# Altium schematic sheet cs301_07b.SchDoc
size A4
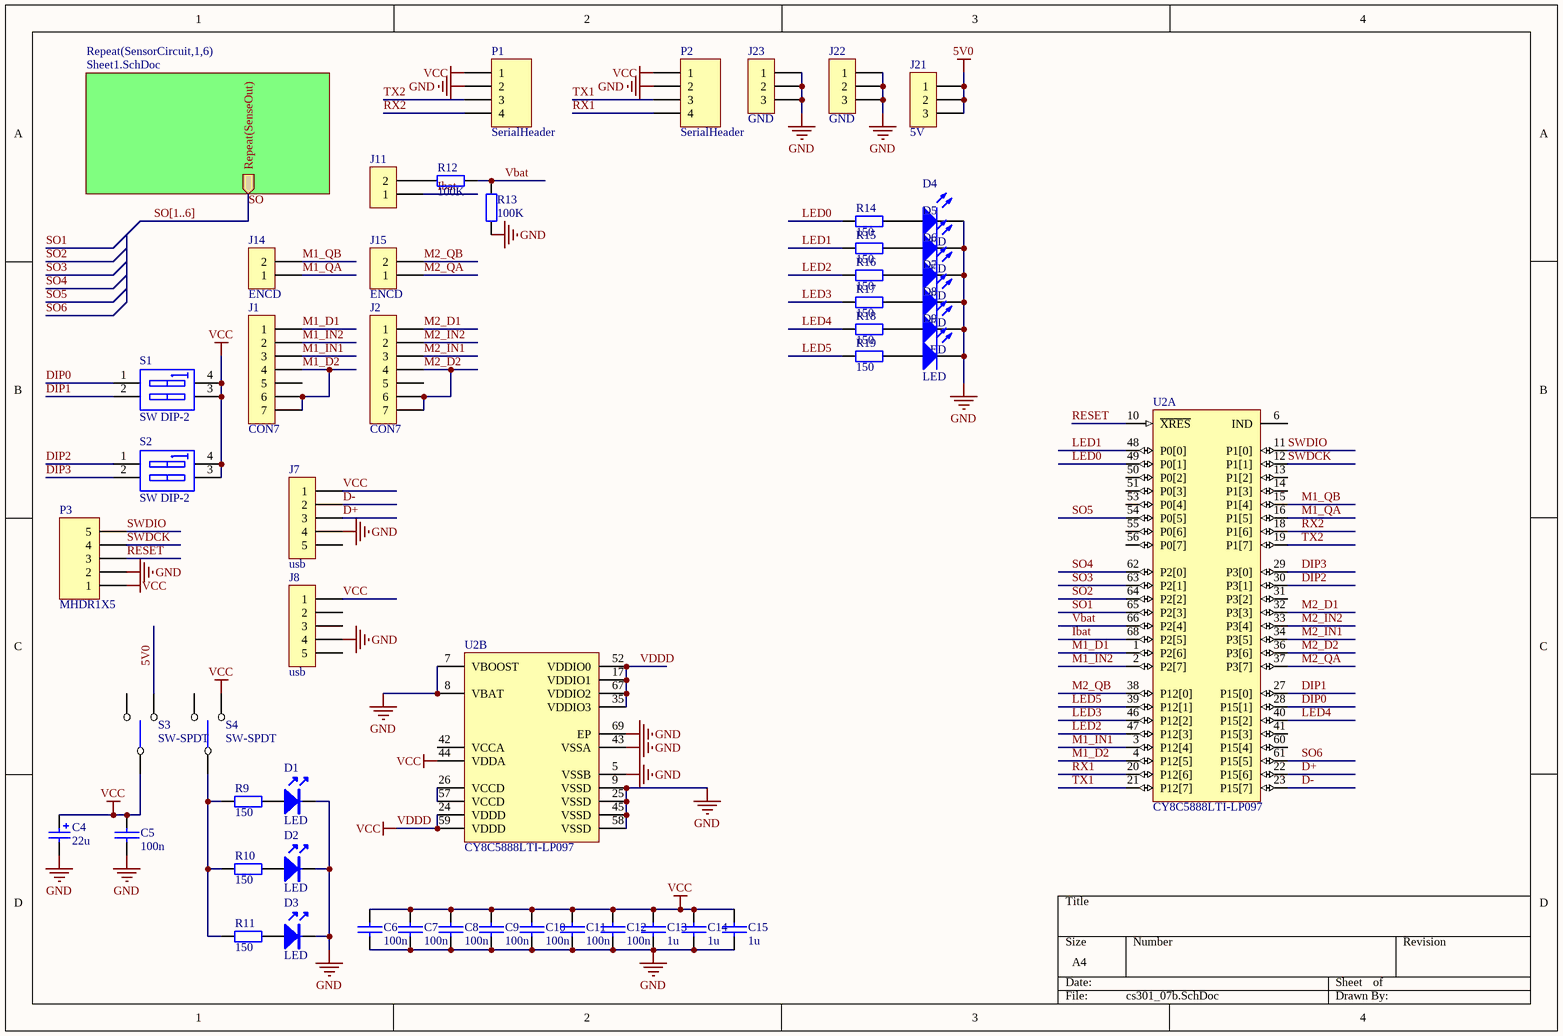
[diagram p0: cs301_07b.SchDoc]

## Parts
C4  22u  [ECE-CAPAE6.3X5.4SM]
C5  100n  [ECE-CAPC1608-0603SM]
C6  100n  [ECE-CAPC1608-0603SM]
C7  100n  [ECE-CAPC1608-0603SM]
C8  100n  [ECE-CAPC1608-0603SM]
C9  100n  [ECE-CAPC1608-0603SM]
C10  100n  [ECE-CAPC1608-0603SM]
C11  100n  [ECE-CAPC1608-0603SM]
C12  100n  [ECE-CAPC1608-0603SM]
C13  1u  [ECE-CAPC1608-0603SM]
C14  1u  [ECE-CAPC1608-0603SM]
C15  1u  [ECE-CAPC1608-0603SM]
D1  LED  [LED0.1/5MM]
D2  LED  [LED0.1/5MM]
D3  LED  [LED0.1/5MM]
D4  LED  [ECE-LED2012-0805SM]
D5  LED  [ECE-LED2012-0805SM]
D6  LED  [ECE-LED2012-0805SM]
D7  LED  [ECE-LED2012-0805SM]
D8  LED  [ECE-LED2012-0805SM]
D9  LED  [ECE-LED2012-0805SM]
J1  CON7  [SIP7]
J2  CON7  [SIP7]
J7  usb  [SIP5]
J8  usb  [SIP5]
J11  Battery  [sip2]  (value not drawn)
J14  ENCD  [sip2]
J15  ENCD  [sip2]
J21  5V  [sip3]
J22  GND  [sip3]
J23  GND  [sip3]
P1  SerialHeader  [HDR1X4]
P2  SerialHeader  [HDR1X4]
P3  MHDR1X5  [MHDR1X5]
R9  150  [ECE-RESC1608-0603SM]
R10  150  [ECE-RESC1608-0603SM]
R11  150  [ECE-RESC1608-0603SM]
R12  100K  [ECE-RESC1608-0603SM]
R13  100K  [ECE-RESC1608-0603SM]
R14  150  [ECE-RESC1608-0603SM]
R15  150  [ECE-RESC1608-0603SM]
R16  150  [ECE-RESC1608-0603SM]
R17  150  [ECE-RESC1608-0603SM]
R18  150  [ECE-RESC1608-0603SM]
R19  150  [ECE-RESC1608-0603SM]
S1  SW DIP-2  [DIP-4]
S2  SW DIP-2  [DIP-4]
S3  SW-SPDT  [SW-SPDT]
S4  SW-SPDT  [SW-SPDT]
U2  CY8C5888LTI-LP097  [CYP-LTX68_N]  (parts A,B of 2)

## Sub-sheets
Repeat(SensorCircuit,1,6) = Sheet1.SchDoc: Repeat(SenseOut) (out)

## Nets
5V0: J21.1 J21.2 J21.3 S3.3
GND: C4.2 C5.1 C6.1 C7.1 C8.1 C9.1 C10.1 C11.1 C12.1 C13.1 C14.1 C15.1 D1.K D2.K D3.K D4.2(K) D5.2(K) D6.2(K) D7.2(K) D8.2(K) D9.2(K) J7.4 J8.4 J22.1 J22.2 J22.3 J23.1 J23.2 J23.3 P1.2 P2.2 P3.2 R13.2 U2.5(VSSB) U2.7(VBOOST) U2.8(VBAT) U2.9(VSSD) U2.25(VSSD) U2.43(VSSA) U2.45(VSSD) U2.58(VSSD) U2.69(EP)
VCC: C4.1 C5.2 C6.2 C7.2 C8.2 C9.2 C10.2 C11.2 C12.2 C13.2 C14.2 C15.2 J7.1 J8.1 P1.1 P2.1 P3.1 S1.3(B2) S1.4(B1) S2.3(B2) S2.4(B1) S3.2 S4.3 U2.17(VDDIO1) U2.24(VDDD) U2.35(VDDIO3) U2.44(VDDA) U2.52(VDDIO0) U2.59(VDDD) U2.67(VDDIO2)  [also labelled VDDD]
D+: J7.3 U2.22(P15[6])
D-: J7.2 U2.23(P15[7])
DIP0: S1.1(A1) U2.28(P15[1])
DIP1: S1.2(A2) U2.27(P15[0])
DIP2: S2.1(A1) U2.30(P3[1])
DIP3: S2.2(A2) U2.29(P3[0])
Ibat: J11.1 U2.68(P2[5])
LED0: R14.1 U2.49(P0[1])
LED1: R15.1 U2.48(P0[0])
LED2: R16.1 U2.47(P12[3])
LED3: R17.1 U2.46(P12[2])
LED4: R18.1 U2.40(P15[2])
LED5: R19.1 U2.39(P12[1])
M1_D1: J1.1 U2.1(P2[6])
M1_D2: J1.4 J1.6 J1.7 U2.4(P12[5])
M1_IN1: J1.3 U2.3(P12[4])
M1_IN2: J1.2 U2.2(P2[7])
M1_QA: J14.1 U2.16(P1[5])
M1_QB: J14.2 U2.15(P1[4])
M2_D1: J2.1 U2.32(P3[3])
M2_D2: J2.4 J2.6 J2.7 U2.36(P3[6])
M2_IN1: J2.3 U2.34(P3[5])
M2_IN2: J2.2 U2.33(P3[4])
M2_QA: J15.1 U2.37(P3[7])
M2_QB: J15.2 U2.38(P12[0])
RESET: P3.3 U2.10(~{XRES})
RX1: P2.4 U2.20(P12[6])
RX2: P1.4 U2.18(P1[6])
SO: sheet Repeat(SensorCircuit,1,6)/Repeat(SenseOut)
SO1: U2.65(P2[3])
SO2: U2.64(P2[2])
SO3: U2.63(P2[1])
SO4: U2.62(P2[0])
SO5: U2.54(P0[5])
SO6: U2.61(P15[5])
SWDCK: P3.4 U2.12(P1[1])
SWDIO: P3.5 U2.11(P1[0])
TX1: P2.3 U2.21(P12[7])
TX2: P1.3 U2.19(P1[7])
Vbat: R12.2 R13.1 U2.66(P2[4])
NetD1_A: D1.A R9.2
NetD2_A: D2.A R10.2
NetD3_A: D3.A R11.2
NetD4_1: D4.1(A) R14.2
NetD5_1: D5.1(A) R15.2
NetD6_1: D6.1(A) R16.2
NetD7_1: D7.1(A) R17.2
NetD8_1: D8.1(A) R18.2
NetD9_1: D9.1(A) R19.2
NetJ11_2: J11.2 R12.1
NetR9_1: R9.1 R10.1 R11.1 S4.2
NetU2_26: U2.26(VCCD) U2.57(VCCD)

Not connected (* = marked no-connect by the designer): J1 5; J2 5; J7 5; J8 2 3 5; S3 1; S4 1; U2 6(IND) 13(P1[2]) 14(P1[3]) 31(P3[2]) 41(P15[3]) 42(VCCA) 50(P0[2]) 51(P0[3]) 53(P0[4]) 55(P0[6]) 56(P0[7]) 60(P15[4])

## Buses and harness runs
bus SO[1..6]

## Library data of the parts
C4 = CAP000304: CAP 22uF 35V ELE SM; Revision: July-2002: Re-released for DXP Platform.; Value: 22u; UoA Stock#: CAP000304
C5-C12 = CAP000624: CAP CER 100nF 25V X7R SM0603; Value: 100n; UoA Stock#: CAP000624
C13-C15 = CAP000630: CAP CER 1uF 50V X7R SM0603; Value: 1u; UoA Stock#: CAP000630
D4-D9 = DIO000105: LED RED ORANGE CLEAR 0805 SMD; UoA Stock#: DIO000105
J1 J2 = CON7: Connector
J7 J8 = CON5: Connector
J11 J14 J15 = CON2: Connector
J21-J23 = CON3: Connector
P1 P2 = Header 4: Header, 4-Pin; LatestRevisionDate: 17-Jul-2002; LatestRevisionNote: Re-released for DXP Platform.; Publisher: Altium Limited
P3 = MHDR1X5: Header, 5-Pin; LatestRevisionDate: 17-Jul-2002; LatestRevisionNote: Re-released for DXP Platform.; Publisher: Altium Limited
R9-R11 R14-R19 = RES000128: RES CER 150R 1608 SM; Value: 150; UoA Stock#: RES000128
R12 R13 = RES000162: RES CER 100K 1608 SM; Value: 100K; UoA Stock#: RES000162
S1 S2 = SW DIP-2: DIP Switch, 2 Position, SPST; Published: 24-Mar-1999; LatestRevisionDate: 17-Jul-2002; LatestRevisionNote: Re-released for DXP Platform.; PackageReference: DIP-4; Publisher: Altium Limited
S3 S4 = SW-SPDT: Toggle Switch
U2 = CY8C5888LTI-LP097: PSoC Programmable System-on-Chip, 256 KB Flash, 38 GPIOs, 1.71 to 5.5 V, 68-Pin QFN (LTX68), Tray; Manufacturer: Cypress; CPU Core: ARM Cortex-M3; Flash (KB): 256; Max. Operating Frequency (MHz): 80; Max. Operating Voltage (V): 5.5; Min. Operating Voltage (V): 1.71; No. of GPIOs: 38; SRAM (KB): 64; DatasheetVersion: Rev. *E; PackageVersion: Rev. *E, 07/2012; PackageReference: LTX68; PackageDescription: 68-Pin Quad Flat No Lead, Body 8.00 x 8.00 mm, Pitch 0.40 mm; Max. Operating Temp. (degreesC): 85; Min. Operating Temp. (degreesC): -40; Packing: Tray; Mounting Technology: Surface Mount; Code_JEDEC: MO-220; PartNumber: CY8C5888LTI-LP097; ComponentLink1Description: Manufacturer URL; ComponentLink1URL: http://www.cypress.com/; ComponentLink2Description: Datasheet; ComponentLink2URL: http://www.cypress.com/?docID=47570; ComponentLink3Description: Package Specification; ComponentLink3URL: http://www.cypress.com/?docID=38892